# Altium schematic sheet sch_mk32_dsd_2022-03-23.schdoc
size 289 x 180 mm; SheetNumber: 1; SheetTotal: 1
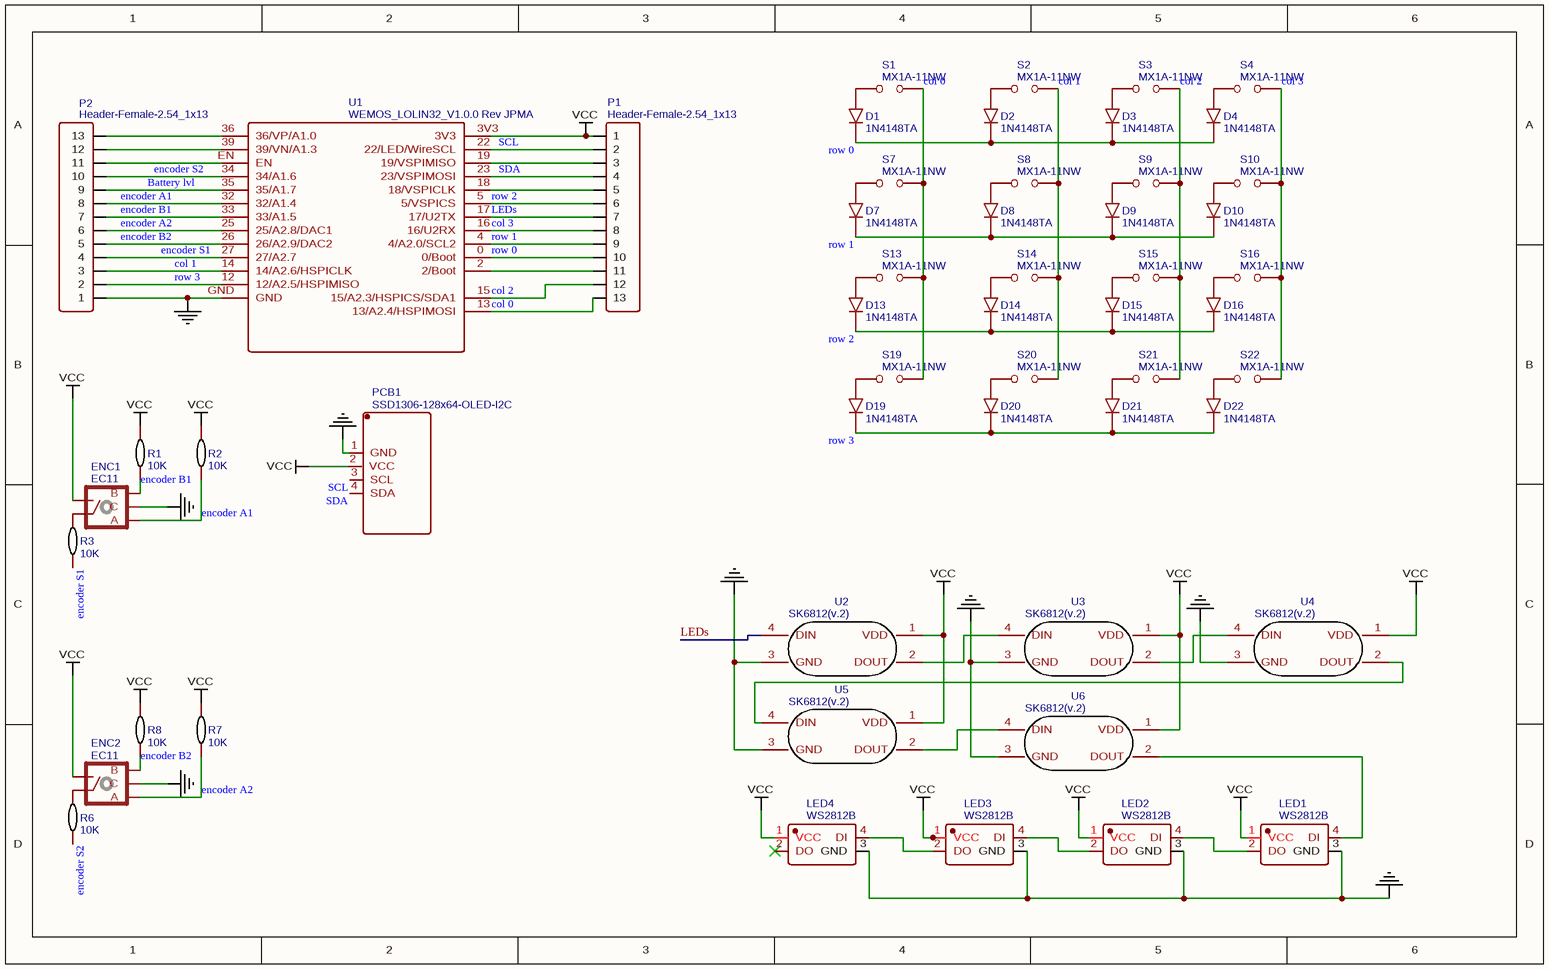
[diagram p0: sch_mk32_dsd_2022-03-23.schdoc]

## Parts
D1  1N4148TA  [DO-35]
D2  1N4148TA  [DO-35]
D3  1N4148TA  [DO-35]
D4  1N4148TA  [DO-35]
D7  1N4148TA  [DO-35]
D8  1N4148TA  [DO-35]
D9  1N4148TA  [DO-35]
D10  1N4148TA  [DO-35]
D13  1N4148TA  [DO-35]
D14  1N4148TA  [DO-35]
D15  1N4148TA  [DO-35]
D16  1N4148TA  [DO-35]
D19  1N4148TA  [DO-35]
D20  1N4148TA  [DO-35]
D21  1N4148TA  [DO-35]
D22  1N4148TA  [DO-35]
ENC1  EC11  [EC11]
ENC2  EC11  [EC11]
LED1  WS2812B  [WS2812B-MIRROR]
LED2  WS2812B  [WS2812B-MIRROR]
LED3  WS2812B  [WS2812B-MIRROR]
LED4  WS2812B  [WS2812B-MIRROR]
P1  Header-Female-2.54_1x13  [HDR-13X1/2.54]
P2  Header-Female-2.54_1x13  [HDR-13X1/2.54]
PCB1  SSD1306-128x64-OLED-I2C  [SSD1306_GNDVCC]
R1  10K  [R03]
R2  10K  [R03]
R3  10K  [R03]
R6  10K  [R03]
R7  10K  [R03]
R8  10K  [R03]
S1  MX1A-11NW  [MX1A]
S2  MX1A-11NW  [MX1A]
S3  MX1A-11NW  [MX1A]
S4  MX1A-11NW  [MX1A]
S7  MX1A-11NW  [MX1A]
S8  MX1A-11NW  [MX1A]
S9  MX1A-11NW  [MX1A]
S10  MX1A-11NW  [MX1A]
S13  MX1A-11NW  [MX1A]
S14  MX1A-11NW  [MX1A]
S15  MX1A-11NW  [MX1A]
S16  MX1A-11NW  [MX1A]
S19  MX1A-11NW  [MX1A]
S20  MX1A-11NW  [MX1A]
S21  MX1A-11NW  [MX1A]
S22  MX1A-11NW  [MX1A]
U1  WEMOS_LOLIN32_V1.0.0 Rev JPMA  [WEMOS LOLIN32 LITE V1.0.0 UC]
U2  SK6812(v.2)  [SK6812MINI-E]
U3  SK6812(v.2)  [SK6812MINI-E]
U4  SK6812(v.2)  [SK6812MINI-E]
U5  SK6812(v.2)  [SK6812MINI-E]
U6  SK6812(v.2)  [SK6812MINI-E]

## Nets
GND: ENC1.5(C) ENC2.5(C) LED1.3(GND) LED2.3(GND) LED3.3(GND) LED4.3(GND) P2.1 PCB1.1(GND) U1.GND U2.3(GND) U3.3(GND) U4.3(GND) U5.3(GND) U6.3(GND)
VCC: ENC1.2 ENC2.2 LED1.1(VCC) LED2.1(VCC) LED3.1(VCC) LED4.1(VCC) P1.1 PCB1.2(VCC) R1.1 R2.1 R7.1 R8.1 U1.3V3 U2.1(VDD) U3.1(VDD) U4.1(VDD) U5.1(VDD) U6.1(VDD)
Battery lvl: P2.9 U1.35(35/A1.7)
col 0: P1.13 S1.2 S7.2 S13.2 S19.2 U1.13(13/A2.4/HSPIMOSI)
col 1: P2.3 S2.2 S8.2 S14.2 S20.2 U1.14(14/A2.6/HSPICLK)
col 2: P1.12 S3.2 S9.2 S15.2 S21.2 U1.15(15/A2.3/HSPICS/SDA1)
col 3: P1.8 S4.2 S10.2 S16.2 S22.2 U1.16(16/U2RX)
encoder A1: ENC1.3(A) P2.8 R2.2 U1.32(32/A1.4)
encoder A2: ENC2.3(A) P2.6 R7.2 U1.25(25/A2.8/DAC1)
encoder B1: ENC1.4(B) P2.7 R1.2 U1.33(33/A1.5)
encoder B2: ENC2.4(B) P2.5 R8.2 U1.26(26/A2.9/DAC2)
encoder S1: P2.4 R3.2 U1.27(27/A2.7)
encoder S2: P2.10 R6.2 U1.34(34/A1.6)
LEDs: P1.7 U1.17(17/U2TX) U2.4(DIN)
row 0: D1.2 D2.2 D3.2 D4.2 P1.10 U1.0(0/Boot)
row 1: D7.2 D8.2 D9.2 D10.2 P1.9 U1.4(4/A2.0/SCL2)
row 2: D13.2 D14.2 D15.2 D16.2 P1.6 U1.5(5/VSPICS)
row 3: D19.2 D20.2 D21.2 D22.2 P2.2 U1.12(12/A2.5/HSPIMISO)
SCL: P1.2 PCB1.3(SCL) U1.22(22/LED/WireSCL)
SDA: P1.4 PCB1.4(SDA) U1.23(23/VSPIMOSI)
NetD1_1: D1.1 S1.1
NetD2_1: D2.1 S2.1
NetD3_1: D3.1 S3.1
NetD4_1: D4.1 S4.1
NetD7_1: D7.1 S7.1
NetD8_1: D8.1 S8.1
NetD9_1: D9.1 S9.1
NetD10_1: D10.1 S10.1
NetD13_1: D13.1 S13.1
NetD14_1: D14.1 S14.1
NetD15_1: D15.1 S15.1
NetD16_1: D16.1 S16.1
NetD19_1: D19.1 S19.1
NetD20_1: D20.1 S20.1
NetD21_1: D21.1 S21.1
NetD22_1: D22.1 S22.1
NetENC1_1: ENC1.1 R3.1
NetENC2_1: ENC2.1 R6.1
NetLED1_2: LED1.2(DO) LED2.4(DI)
NetLED1_4: LED1.4(DI) U6.2(DOUT)
NetLED2_2: LED2.2(DO) LED3.4(DI)
NetLED3_2: LED3.2(DO) LED4.4(DI)
NetP1_3: P1.3 U1.19(19/VSPIMISO)
NetP1_5: P1.5 U1.18(18/VSPICLK)
NetP1_11: P1.11 U1.2(2/Boot)
NetP2_11: P2.11 U1.EN
NetP2_12: P2.12 U1.39(39/VN/A1.3)
NetP2_13: P2.13 U1.36(36/VP/A1.0)
NetU2_2: U2.2(DOUT) U3.4(DIN)
NetU3_2: U3.2(DOUT) U4.4(DIN)
NetU4_2: U4.2(DOUT) U5.4(DIN)
NetU5_2: U5.2(DOUT) U6.4(DIN)

Not connected (* = marked no-connect by the designer): LED4 2(DO)*

## Library data of the parts
D1-D4 D7-D10 D13-D16 D19-D22 = 1N4148TA: BOM_Manufacturer: FAIRCHILD; Contributor: LCSC; BOM_Supplier: LCSC; BOM_Manufacturer Part: 1N4148TA; spicePre: D; BOM_Supplier Part: C124481
ENC1 ENC2 = EC11: sourceId: _kcy86s1ZJ; BOM_Manufacturer Part: ?; spicePre: E
LED1-LED4 = WS2812B: Contributor: ridgy; spicePre: L; spiceSymbolName: WS2812B
P1 P2 = Header-Female-2.54_1x13: BOM_Manufacturer: BOOMELE; BOM_Manufacturer Part: Female header 2.54-1*13P; Contributor: LCSC; BOM_Supplier: LCSC; spicePre: P; BOM_Supplier Part: C52709
PCB1 = SSD1306-128x64-OLED-I2C: sourceId: wICUcuL3l; spicePre: X; timeStamp: 1456014235; BOM_Manufacturer Part: ?
R1-R3 R6-R8 = 10K: Contributor: sorinfxdx; sourceId: J2CYWiEeb; BOM_Manufacturer Part: ?; spicePre: R
U2-U6 = SK6812(v.2): Contributor: PetrSlachta; spicePre: U; spiceSymbolName: SK6812(v.2)
S1-S4 S7-S10 S13-S16 S19-S22 = MX1A-11NW: BOM_Manufacturer Part: MX1A-11NW; BOM_Supplier: Mouser; link: http://cherryamericas.com/wp-content/uploads/2014/12/mx_cat.pdf; spicePre: S; BOM_Supplier Part: 540-MX1A-11NW
U1 = WEMOS_LOLIN32_V1.0.0 Rev JPMA: spicePre: X; Contributor: JPMA; BOM_Manufacturer Part: ?